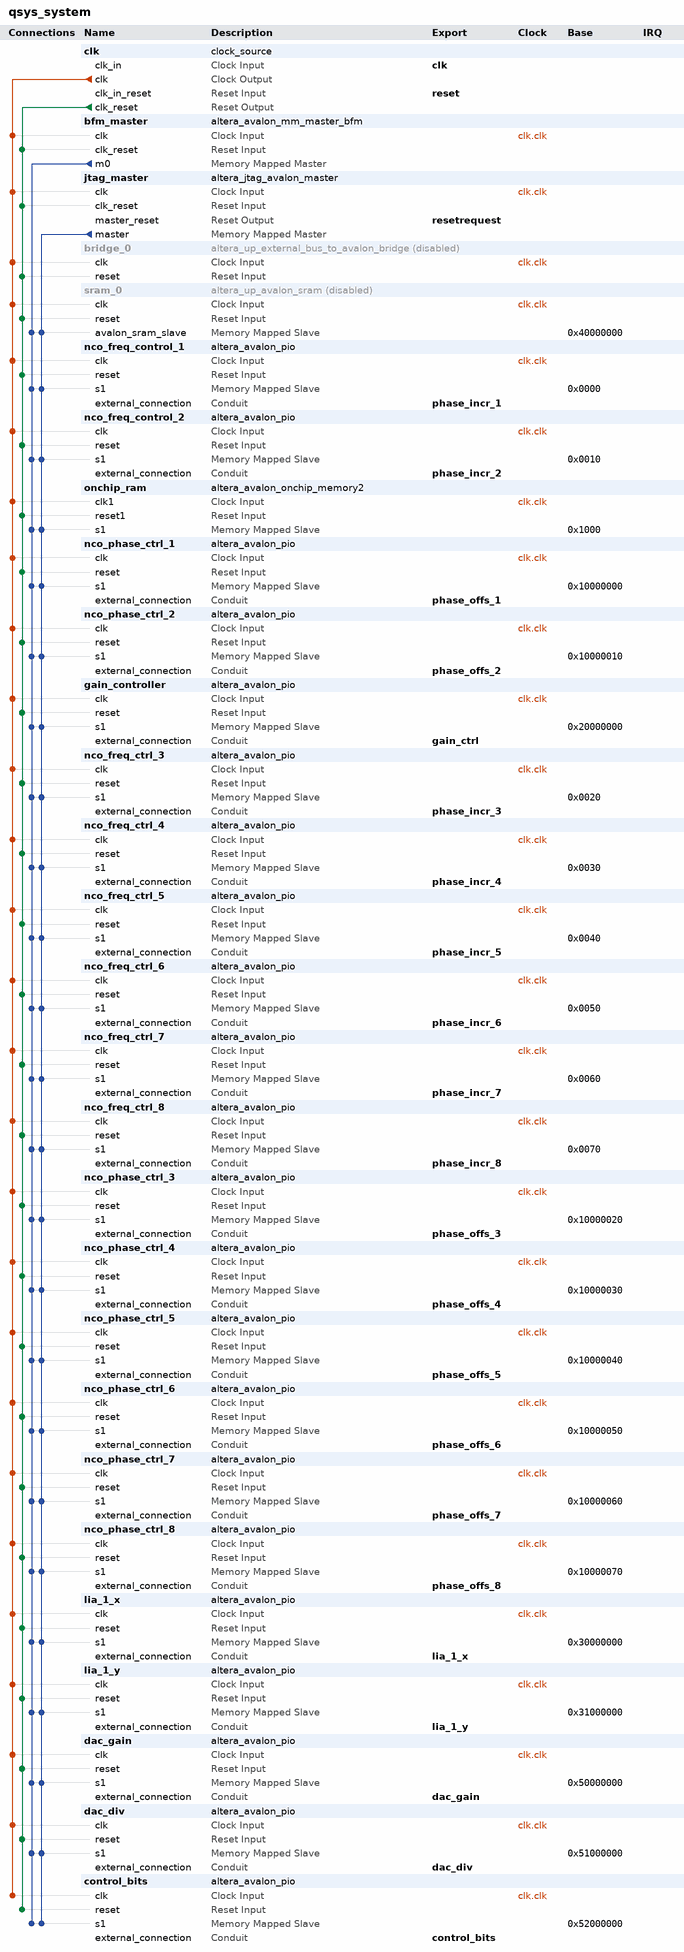
[diagram p0: system contents]
# Platform Designer (Qsys) system qsys_system, Cyclone IV E EP4CE115F29C7
# Parameters at their usual value, and those the tool derives, are not listed.
package require -exact qsys 16.0
create_system qsys_system
set_project_property DEVICE_FAMILY {Cyclone IV E}
set_project_property DEVICE EP4CE115F29C7

add_instance clk clock_source 16.0
set_instance_parameter_value clk clockFrequency 50000000

add_instance bfm_master altera_avalon_mm_master_bfm 16.0
set_instance_parameter_value bfm_master ADDRESS_UNITS SYMBOLS
set_instance_parameter_value bfm_master AV_ADDRESS_W 32
set_instance_parameter_value bfm_master AV_ALWAYS_BURST_MAX_BURST 0
set_instance_parameter_value bfm_master AV_BURSTCOUNT_W 3
set_instance_parameter_value bfm_master AV_BURST_BNDR_ONLY 1
set_instance_parameter_value bfm_master AV_BURST_LINEWRAP 1
set_instance_parameter_value bfm_master AV_CONSTANT_BURST_BEHAVIOR 1
set_instance_parameter_value bfm_master AV_FIX_READ_LATENCY 1
set_instance_parameter_value bfm_master AV_MAX_PENDING_WRITES 0
set_instance_parameter_value bfm_master AV_NUMSYMBOLS 4
set_instance_parameter_value bfm_master AV_READRESPONSE_W 8
set_instance_parameter_value bfm_master AV_READ_WAIT_TIME 1
set_instance_parameter_value bfm_master AV_WRITERESPONSE_W 8
set_instance_parameter_value bfm_master USE_BURSTCOUNT 0
set_instance_parameter_value bfm_master USE_BYTE_ENABLE 1
set_instance_parameter_value bfm_master USE_READ 1
set_instance_parameter_value bfm_master USE_READ_DATA 1
set_instance_parameter_value bfm_master USE_READ_DATA_VALID 1
set_instance_parameter_value bfm_master USE_WAIT_REQUEST 1
set_instance_parameter_value bfm_master VHDL_ID 0

add_instance jtag_master altera_jtag_avalon_master 16.0

add_instance bridge_0 altera_up_external_bus_to_avalon_bridge 15.1
set_instance_property bridge_0 ENABLED false
set_instance_parameter_value bridge_0 addr_size 2
set_instance_parameter_value bridge_0 addr_size_multiplier Mbytes
set_instance_parameter_value bridge_0 data_size 16

add_instance sram_0 altera_up_avalon_sram 15.1
set_instance_property sram_0 ENABLED false
set_instance_parameter_value sram_0 board DE2-115
set_instance_parameter_value sram_0 pixel_buffer false

add_instance nco_freq_control_1 altera_avalon_pio 16.0
set_instance_parameter_value nco_freq_control_1 direction Output
set_instance_parameter_value nco_freq_control_1 resetValue 12623
set_instance_parameter_value nco_freq_control_1 width 20

add_instance nco_freq_control_2 altera_avalon_pio 16.0
set_instance_parameter_value nco_freq_control_2 direction Output
set_instance_parameter_value nco_freq_control_2 resetValue 12623
set_instance_parameter_value nco_freq_control_2 width 20

add_instance onchip_ram altera_avalon_onchip_memory2 16.0
set_instance_parameter_value onchip_ram dataWidth 32
set_instance_parameter_value onchip_ram dualPort false
set_instance_parameter_value onchip_ram initMemContent false
set_instance_parameter_value onchip_ram initializationFileName onchip_mem.hex
set_instance_parameter_value onchip_ram memorySize 4096

add_instance nco_phase_ctrl_1 altera_avalon_pio 16.0
set_instance_parameter_value nco_phase_ctrl_1 direction Output
set_instance_parameter_value nco_phase_ctrl_1 width 20

add_instance nco_phase_ctrl_2 altera_avalon_pio 16.0
set_instance_parameter_value nco_phase_ctrl_2 direction Output
set_instance_parameter_value nco_phase_ctrl_2 width 20

add_instance gain_controller altera_avalon_pio 16.0
set_instance_parameter_value gain_controller direction Output
set_instance_parameter_value gain_controller width 6

add_instance nco_freq_ctrl_3 altera_avalon_pio 16.0
set_instance_parameter_value nco_freq_ctrl_3 direction Output
set_instance_parameter_value nco_freq_ctrl_3 width 20

add_instance nco_freq_ctrl_4 altera_avalon_pio 16.0
set_instance_parameter_value nco_freq_ctrl_4 direction Output
set_instance_parameter_value nco_freq_ctrl_4 width 20

add_instance nco_freq_ctrl_5 altera_avalon_pio 16.0
set_instance_parameter_value nco_freq_ctrl_5 direction Output
set_instance_parameter_value nco_freq_ctrl_5 width 20

add_instance nco_freq_ctrl_6 altera_avalon_pio 16.0
set_instance_parameter_value nco_freq_ctrl_6 direction Output
set_instance_parameter_value nco_freq_ctrl_6 width 20

add_instance nco_freq_ctrl_7 altera_avalon_pio 16.0
set_instance_parameter_value nco_freq_ctrl_7 direction Output
set_instance_parameter_value nco_freq_ctrl_7 width 20

add_instance nco_freq_ctrl_8 altera_avalon_pio 16.0
set_instance_parameter_value nco_freq_ctrl_8 direction Output
set_instance_parameter_value nco_freq_ctrl_8 width 20

add_instance nco_phase_ctrl_3 altera_avalon_pio 16.0
set_instance_parameter_value nco_phase_ctrl_3 direction Output
set_instance_parameter_value nco_phase_ctrl_3 width 20

add_instance nco_phase_ctrl_4 altera_avalon_pio 16.0
set_instance_parameter_value nco_phase_ctrl_4 direction Output
set_instance_parameter_value nco_phase_ctrl_4 width 20

add_instance nco_phase_ctrl_5 altera_avalon_pio 16.0
set_instance_parameter_value nco_phase_ctrl_5 direction Output
set_instance_parameter_value nco_phase_ctrl_5 width 20

add_instance nco_phase_ctrl_6 altera_avalon_pio 16.0
set_instance_parameter_value nco_phase_ctrl_6 direction Output
set_instance_parameter_value nco_phase_ctrl_6 width 20

add_instance nco_phase_ctrl_7 altera_avalon_pio 16.0
set_instance_parameter_value nco_phase_ctrl_7 direction Output
set_instance_parameter_value nco_phase_ctrl_7 width 20

add_instance nco_phase_ctrl_8 altera_avalon_pio 16.0
set_instance_parameter_value nco_phase_ctrl_8 direction Output
set_instance_parameter_value nco_phase_ctrl_8 width 20

add_instance lia_1_x altera_avalon_pio 16.0
set_instance_parameter_value lia_1_x direction Input
set_instance_parameter_value lia_1_x width 16

add_instance lia_1_y altera_avalon_pio 16.0
set_instance_parameter_value lia_1_y direction Input
set_instance_parameter_value lia_1_y width 16

add_instance dac_gain altera_avalon_pio 16.0
set_instance_parameter_value dac_gain direction Output
set_instance_parameter_value dac_gain resetValue 1
set_instance_parameter_value dac_gain width 8

add_instance dac_div altera_avalon_pio 16.0
set_instance_parameter_value dac_div direction Output
set_instance_parameter_value dac_div width 8

add_instance control_bits altera_avalon_pio 16.0
set_instance_parameter_value control_bits direction Output
set_instance_parameter_value control_bits width 8

# connections
add_connection clk.clk bfm_master.clk clock
add_connection clk.clk bridge_0.clk clock
add_connection clk.clk control_bits.clk clock
add_connection clk.clk dac_div.clk clock
add_connection clk.clk dac_gain.clk clock
add_connection clk.clk gain_controller.clk clock
add_connection clk.clk jtag_master.clk clock
add_connection clk.clk lia_1_x.clk clock
add_connection clk.clk lia_1_y.clk clock
add_connection clk.clk nco_freq_control_1.clk clock
add_connection clk.clk nco_freq_control_2.clk clock
add_connection clk.clk nco_freq_ctrl_3.clk clock
add_connection clk.clk nco_freq_ctrl_4.clk clock
add_connection clk.clk nco_freq_ctrl_5.clk clock
add_connection clk.clk nco_freq_ctrl_6.clk clock
add_connection clk.clk nco_freq_ctrl_7.clk clock
add_connection clk.clk nco_freq_ctrl_8.clk clock
add_connection clk.clk nco_phase_ctrl_1.clk clock
add_connection clk.clk nco_phase_ctrl_2.clk clock
add_connection clk.clk nco_phase_ctrl_3.clk clock
add_connection clk.clk nco_phase_ctrl_4.clk clock
add_connection clk.clk nco_phase_ctrl_5.clk clock
add_connection clk.clk nco_phase_ctrl_6.clk clock
add_connection clk.clk nco_phase_ctrl_7.clk clock
add_connection clk.clk nco_phase_ctrl_8.clk clock
add_connection clk.clk onchip_ram.clk1 clock
add_connection clk.clk sram_0.clk clock
add_connection clk.clk_reset bfm_master.clk_reset reset
add_connection clk.clk_reset bridge_0.reset reset
add_connection clk.clk_reset control_bits.reset reset
add_connection clk.clk_reset dac_div.reset reset
add_connection clk.clk_reset dac_gain.reset reset
add_connection clk.clk_reset gain_controller.reset reset
add_connection clk.clk_reset jtag_master.clk_reset reset
add_connection clk.clk_reset lia_1_x.reset reset
add_connection clk.clk_reset lia_1_y.reset reset
add_connection clk.clk_reset nco_freq_control_1.reset reset
add_connection clk.clk_reset nco_freq_control_2.reset reset
add_connection clk.clk_reset nco_freq_ctrl_3.reset reset
add_connection clk.clk_reset nco_freq_ctrl_4.reset reset
add_connection clk.clk_reset nco_freq_ctrl_5.reset reset
add_connection clk.clk_reset nco_freq_ctrl_6.reset reset
add_connection clk.clk_reset nco_freq_ctrl_7.reset reset
add_connection clk.clk_reset nco_freq_ctrl_8.reset reset
add_connection clk.clk_reset nco_phase_ctrl_1.reset reset
add_connection clk.clk_reset nco_phase_ctrl_2.reset reset
add_connection clk.clk_reset nco_phase_ctrl_3.reset reset
add_connection clk.clk_reset nco_phase_ctrl_4.reset reset
add_connection clk.clk_reset nco_phase_ctrl_5.reset reset
add_connection clk.clk_reset nco_phase_ctrl_6.reset reset
add_connection clk.clk_reset nco_phase_ctrl_7.reset reset
add_connection clk.clk_reset nco_phase_ctrl_8.reset reset
add_connection clk.clk_reset onchip_ram.reset1 reset
add_connection clk.clk_reset sram_0.reset reset
add_connection bfm_master.m0 control_bits.s1 avalon
set_connection_parameter_value bfm_master.m0/control_bits.s1 baseAddress 0x52000000
add_connection bfm_master.m0 dac_div.s1 avalon
set_connection_parameter_value bfm_master.m0/dac_div.s1 baseAddress 0x51000000
add_connection bfm_master.m0 dac_gain.s1 avalon
set_connection_parameter_value bfm_master.m0/dac_gain.s1 baseAddress 0x50000000
add_connection bfm_master.m0 gain_controller.s1 avalon
set_connection_parameter_value bfm_master.m0/gain_controller.s1 baseAddress 0x20000000
add_connection bfm_master.m0 lia_1_x.s1 avalon
set_connection_parameter_value bfm_master.m0/lia_1_x.s1 baseAddress 0x30000000
add_connection bfm_master.m0 lia_1_y.s1 avalon
set_connection_parameter_value bfm_master.m0/lia_1_y.s1 baseAddress 0x31000000
add_connection bfm_master.m0 nco_freq_control_1.s1 avalon
set_connection_parameter_value bfm_master.m0/nco_freq_control_1.s1 baseAddress 0x0000
add_connection bfm_master.m0 nco_freq_control_2.s1 avalon
set_connection_parameter_value bfm_master.m0/nco_freq_control_2.s1 baseAddress 0x0010
add_connection bfm_master.m0 nco_freq_ctrl_3.s1 avalon
set_connection_parameter_value bfm_master.m0/nco_freq_ctrl_3.s1 baseAddress 0x0020
add_connection bfm_master.m0 nco_freq_ctrl_4.s1 avalon
set_connection_parameter_value bfm_master.m0/nco_freq_ctrl_4.s1 baseAddress 0x0030
add_connection bfm_master.m0 nco_freq_ctrl_5.s1 avalon
set_connection_parameter_value bfm_master.m0/nco_freq_ctrl_5.s1 baseAddress 0x0040
add_connection bfm_master.m0 nco_freq_ctrl_6.s1 avalon
set_connection_parameter_value bfm_master.m0/nco_freq_ctrl_6.s1 baseAddress 0x0050
add_connection bfm_master.m0 nco_freq_ctrl_7.s1 avalon
set_connection_parameter_value bfm_master.m0/nco_freq_ctrl_7.s1 baseAddress 0x0060
add_connection bfm_master.m0 nco_freq_ctrl_8.s1 avalon
set_connection_parameter_value bfm_master.m0/nco_freq_ctrl_8.s1 baseAddress 0x0070
add_connection bfm_master.m0 nco_phase_ctrl_1.s1 avalon
set_connection_parameter_value bfm_master.m0/nco_phase_ctrl_1.s1 baseAddress 0x10000000
add_connection bfm_master.m0 nco_phase_ctrl_2.s1 avalon
set_connection_parameter_value bfm_master.m0/nco_phase_ctrl_2.s1 baseAddress 0x10000010
add_connection bfm_master.m0 nco_phase_ctrl_3.s1 avalon
set_connection_parameter_value bfm_master.m0/nco_phase_ctrl_3.s1 baseAddress 0x10000020
add_connection bfm_master.m0 nco_phase_ctrl_4.s1 avalon
set_connection_parameter_value bfm_master.m0/nco_phase_ctrl_4.s1 baseAddress 0x10000030
add_connection bfm_master.m0 nco_phase_ctrl_5.s1 avalon
set_connection_parameter_value bfm_master.m0/nco_phase_ctrl_5.s1 baseAddress 0x10000040
add_connection bfm_master.m0 nco_phase_ctrl_6.s1 avalon
set_connection_parameter_value bfm_master.m0/nco_phase_ctrl_6.s1 baseAddress 0x10000050
add_connection bfm_master.m0 nco_phase_ctrl_7.s1 avalon
set_connection_parameter_value bfm_master.m0/nco_phase_ctrl_7.s1 baseAddress 0x10000060
add_connection bfm_master.m0 nco_phase_ctrl_8.s1 avalon
set_connection_parameter_value bfm_master.m0/nco_phase_ctrl_8.s1 baseAddress 0x10000070
add_connection bfm_master.m0 onchip_ram.s1 avalon
set_connection_parameter_value bfm_master.m0/onchip_ram.s1 baseAddress 0x1000
add_connection bfm_master.m0 sram_0.avalon_sram_slave avalon
set_connection_parameter_value bfm_master.m0/sram_0.avalon_sram_slave baseAddress 0x40000000
add_connection jtag_master.master control_bits.s1 avalon
set_connection_parameter_value jtag_master.master/control_bits.s1 baseAddress 0x52000000
add_connection jtag_master.master dac_div.s1 avalon
set_connection_parameter_value jtag_master.master/dac_div.s1 baseAddress 0x51000000
add_connection jtag_master.master dac_gain.s1 avalon
set_connection_parameter_value jtag_master.master/dac_gain.s1 baseAddress 0x50000000
add_connection jtag_master.master gain_controller.s1 avalon
set_connection_parameter_value jtag_master.master/gain_controller.s1 baseAddress 0x20000000
add_connection jtag_master.master lia_1_x.s1 avalon
set_connection_parameter_value jtag_master.master/lia_1_x.s1 baseAddress 0x30000000
add_connection jtag_master.master lia_1_y.s1 avalon
set_connection_parameter_value jtag_master.master/lia_1_y.s1 baseAddress 0x31000000
add_connection jtag_master.master nco_freq_control_1.s1 avalon
set_connection_parameter_value jtag_master.master/nco_freq_control_1.s1 baseAddress 0x0000
add_connection jtag_master.master nco_freq_control_2.s1 avalon
set_connection_parameter_value jtag_master.master/nco_freq_control_2.s1 baseAddress 0x0010
add_connection jtag_master.master nco_freq_ctrl_3.s1 avalon
set_connection_parameter_value jtag_master.master/nco_freq_ctrl_3.s1 baseAddress 0x0020
add_connection jtag_master.master nco_freq_ctrl_4.s1 avalon
set_connection_parameter_value jtag_master.master/nco_freq_ctrl_4.s1 baseAddress 0x0030
add_connection jtag_master.master nco_freq_ctrl_5.s1 avalon
set_connection_parameter_value jtag_master.master/nco_freq_ctrl_5.s1 baseAddress 0x0040
add_connection jtag_master.master nco_freq_ctrl_6.s1 avalon
set_connection_parameter_value jtag_master.master/nco_freq_ctrl_6.s1 baseAddress 0x0050
add_connection jtag_master.master nco_freq_ctrl_7.s1 avalon
set_connection_parameter_value jtag_master.master/nco_freq_ctrl_7.s1 baseAddress 0x0060
add_connection jtag_master.master nco_freq_ctrl_8.s1 avalon
set_connection_parameter_value jtag_master.master/nco_freq_ctrl_8.s1 baseAddress 0x0070
add_connection jtag_master.master nco_phase_ctrl_1.s1 avalon
set_connection_parameter_value jtag_master.master/nco_phase_ctrl_1.s1 baseAddress 0x10000000
add_connection jtag_master.master nco_phase_ctrl_2.s1 avalon
set_connection_parameter_value jtag_master.master/nco_phase_ctrl_2.s1 baseAddress 0x10000010
add_connection jtag_master.master nco_phase_ctrl_3.s1 avalon
set_connection_parameter_value jtag_master.master/nco_phase_ctrl_3.s1 baseAddress 0x10000020
add_connection jtag_master.master nco_phase_ctrl_4.s1 avalon
set_connection_parameter_value jtag_master.master/nco_phase_ctrl_4.s1 baseAddress 0x10000030
add_connection jtag_master.master nco_phase_ctrl_5.s1 avalon
set_connection_parameter_value jtag_master.master/nco_phase_ctrl_5.s1 baseAddress 0x10000040
add_connection jtag_master.master nco_phase_ctrl_6.s1 avalon
set_connection_parameter_value jtag_master.master/nco_phase_ctrl_6.s1 baseAddress 0x10000050
add_connection jtag_master.master nco_phase_ctrl_7.s1 avalon
set_connection_parameter_value jtag_master.master/nco_phase_ctrl_7.s1 baseAddress 0x10000060
add_connection jtag_master.master nco_phase_ctrl_8.s1 avalon
set_connection_parameter_value jtag_master.master/nco_phase_ctrl_8.s1 baseAddress 0x10000070
add_connection jtag_master.master onchip_ram.s1 avalon
set_connection_parameter_value jtag_master.master/onchip_ram.s1 baseAddress 0x1000
add_connection jtag_master.master sram_0.avalon_sram_slave avalon
set_connection_parameter_value jtag_master.master/sram_0.avalon_sram_slave baseAddress 0x40000000

# exported interfaces
add_interface clk clock sink
set_interface_property clk EXPORT_OF clk.clk_in
add_interface control_bits conduit end
set_interface_property control_bits EXPORT_OF control_bits.external_connection
add_interface dac_div conduit end
set_interface_property dac_div EXPORT_OF dac_div.external_connection
add_interface dac_gain conduit end
set_interface_property dac_gain EXPORT_OF dac_gain.external_connection
add_interface gain_ctrl conduit end
set_interface_property gain_ctrl EXPORT_OF gain_controller.external_connection
add_interface lia_1_x conduit end
set_interface_property lia_1_x EXPORT_OF lia_1_x.external_connection
add_interface lia_1_y conduit end
set_interface_property lia_1_y EXPORT_OF lia_1_y.external_connection
add_interface phase_incr_1 conduit end
set_interface_property phase_incr_1 EXPORT_OF nco_freq_control_1.external_connection
add_interface phase_incr_2 conduit end
set_interface_property phase_incr_2 EXPORT_OF nco_freq_control_2.external_connection
add_interface phase_incr_3 conduit end
set_interface_property phase_incr_3 EXPORT_OF nco_freq_ctrl_3.external_connection
add_interface phase_incr_4 conduit end
set_interface_property phase_incr_4 EXPORT_OF nco_freq_ctrl_4.external_connection
add_interface phase_incr_5 conduit end
set_interface_property phase_incr_5 EXPORT_OF nco_freq_ctrl_5.external_connection
add_interface phase_incr_6 conduit end
set_interface_property phase_incr_6 EXPORT_OF nco_freq_ctrl_6.external_connection
add_interface phase_incr_7 conduit end
set_interface_property phase_incr_7 EXPORT_OF nco_freq_ctrl_7.external_connection
add_interface phase_incr_8 conduit end
set_interface_property phase_incr_8 EXPORT_OF nco_freq_ctrl_8.external_connection
add_interface phase_offs_1 conduit end
set_interface_property phase_offs_1 EXPORT_OF nco_phase_ctrl_1.external_connection
add_interface phase_offs_2 conduit end
set_interface_property phase_offs_2 EXPORT_OF nco_phase_ctrl_2.external_connection
add_interface phase_offs_3 conduit end
set_interface_property phase_offs_3 EXPORT_OF nco_phase_ctrl_3.external_connection
add_interface phase_offs_4 conduit end
set_interface_property phase_offs_4 EXPORT_OF nco_phase_ctrl_4.external_connection
add_interface phase_offs_5 conduit end
set_interface_property phase_offs_5 EXPORT_OF nco_phase_ctrl_5.external_connection
add_interface phase_offs_6 conduit end
set_interface_property phase_offs_6 EXPORT_OF nco_phase_ctrl_6.external_connection
add_interface phase_offs_7 conduit end
set_interface_property phase_offs_7 EXPORT_OF nco_phase_ctrl_7.external_connection
add_interface phase_offs_8 conduit end
set_interface_property phase_offs_8 EXPORT_OF nco_phase_ctrl_8.external_connection
add_interface reset reset sink
set_interface_property reset EXPORT_OF clk.clk_in_reset
add_interface resetrequest reset source
set_interface_property resetrequest EXPORT_OF jtag_master.master_reset

set_interconnect_requirement {$system} qsys_mm.clockCrossingAdapter HANDSHAKE
set_interconnect_requirement {$system} qsys_mm.enableEccProtection FALSE
set_interconnect_requirement {$system} qsys_mm.insertDefaultSlave FALSE
set_interconnect_requirement {$system} qsys_mm.maxAdditionalLatency 1

save_system qsys_system.qsys
